# EAGLE design lm3410-sepic-flashlight-driver-17mm-mk-1.1.0 (EAGLE 9.2.0)
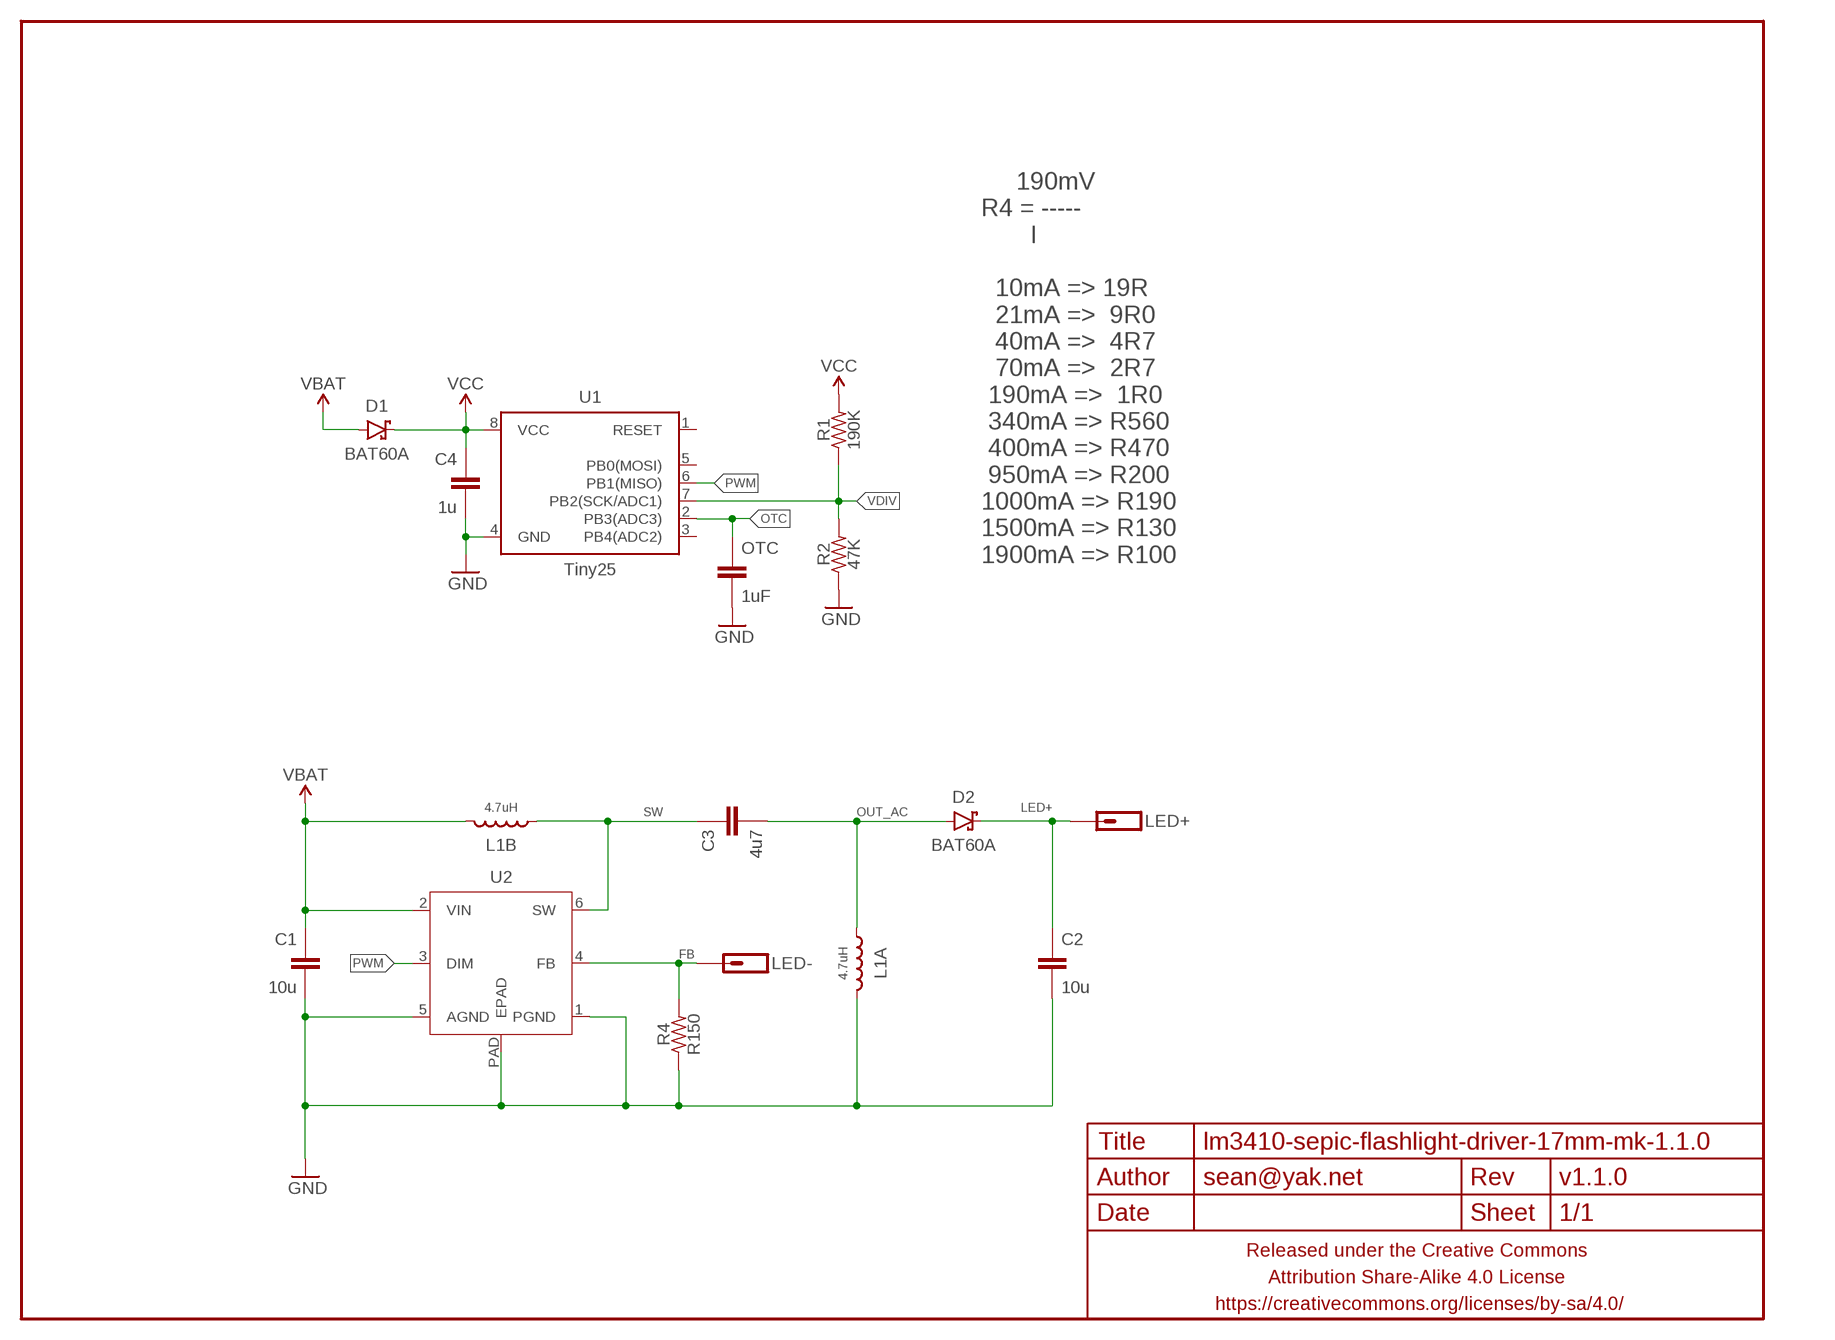
[diagram p0: schematic, sheet 1]

## Parts
C1  10u  CAPACITOR-CERAMICC0805-TIGHTER  [C0805-TIGHTER]
C2  10u  CAPACITOR-CERAMICC0805-TIGHTER  [C0805-TIGHTER]
C3  4u7  CAPACITOR-CERAMICC0805-TIGHTER  [C0805-TIGHTER]
C4  1u  CAPACITOR-CERAMICC0402  [C0402]
D1  BAT60A  DIODE-SCHOTTKYSOD323  [SOD323-SCHOTTKY]
D2  BAT60A  DIODE-SCHOTTKYSOD323  [SOD323-SCHOTTKY]
FRAME1  FRAME-LETTERNO_PACKAGE  [DUMMY]
L1  4.7uH  INDUCTOR-DUALCOILCRAFT-LPD5030-SMALLER  [LPD5030-SMALLER-PADS]
LED+  M01PTH-1MM-CIR-NS  [1X01-1MM-CIR-NS]
LED-  M01PTH-1MM-CIR-NS  [1X01-1MM-CIR-NS]
OTC  1uF  CAPACITOR-CERAMICC0402  [C0402]
R1  190K  RESISTORR0402  [R0402]
R2  47K  RESISTORR0402  [R0402]
R4  R150  RESISTORR0805-TIGHTER  [R0805-TIGHTER]
U1  Tiny25  ATTINY45TINY25-SOICN-NARROWER  [SO08-SKINNYPADS]
U2  LM3410XSDNGG  [DFN300X300X80-7N]

## Nets
FB: LED-.1 R4.2 U2.4(FB)
GND: C1.2 C2.2 C4.2 L1.2 OTC.2 R2.1 R4.1 U1.4(GND) U2.1(PGND) U2.5(AGND) U2.PAD(EPAD)
LED+: C2.1 D2.C LED+.1
OTC: OTC.1 U1.2(PB3(ADC3))
OUT_AC: C3.2 D2.A L1.1
PWM: U1.6(PB1(MISO)) U2.3(DIM)
SW: C3.1 L1.4 U2.6(SW)
VBAT: C1.1 D1.A L1.3 U2.2(VIN)
VCC: C4.1 D1.C R1.2 U1.8(VCC)
VDIV: R1.1 R2.2 U1.7(PB2(SCK/ADC1))
Unconnected: U1.1(RESET) U1.3(PB4(ADC2)) U1.5(PB0(MOSI))

## Notes on the sheet
- 190mV
  R4 = -----
         I
  
    10mA => 19R
    21mA =>  9R0
    40mA =>  4R7
    70mA =>  2R7
   190mA =>  1R0
   340mA => R560
   400mA => R470
   950mA => R200
  1000mA => R190
  1500mA => R130
  1900mA => R100

## Library data of the parts
C1-C4 OTC = a_parts:CAPACITOR-CERAMIC: CAPACITOR, European symbol
D1 D2 = a_parts:DIODE-SCHOTTKY: Schottky diodes in SFE's production catalog BAT20J 1A 23V 0.62Vf RB751 120mA 40V 0.37Vf PMEG4005EJ 0.5A 40V 0.42Vf MBRA140 1A 40V 0.5Vf B340A 3A 40V SMA
FRAME1 = a_parts:FRAME-LETTER: Schematic Frame Standard 8.5x11 US Letter frame; DESIGNER: sean@yak.net; VERSION: v1.1.0
L1 = a_parts:INDUCTOR-DUAL
LED+ LED- = a_parts:M01: Header 1 Standard 1-pin 0.1" header. Use with straight break away headers (SKU : PRT-00116), right angle break away headers (PRT-00553), swiss pins (PRT-00743), machine pins (PRT-00117), and female headers (PRT-00115).
R1 R2 R4 = a_parts:RESISTOR: RESISTOR, American symbol
U1 = a_parts:ATTINY45: Atmel 8-pin 2/4/8kB flash uC
U2 = a_parts:LM3410XSD: Constant Current Boost and SEPIC LED Driver; MPN: LM3410XSD; OC_FARNELL: -; OC_NEWARK: 11N9218; PACKAGE: DFN-6; SUPPLIER: National Semiconductor

## Board
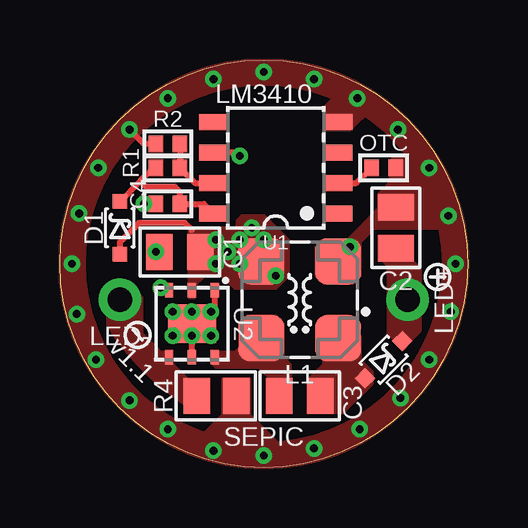
[diagram p1: board, top side]
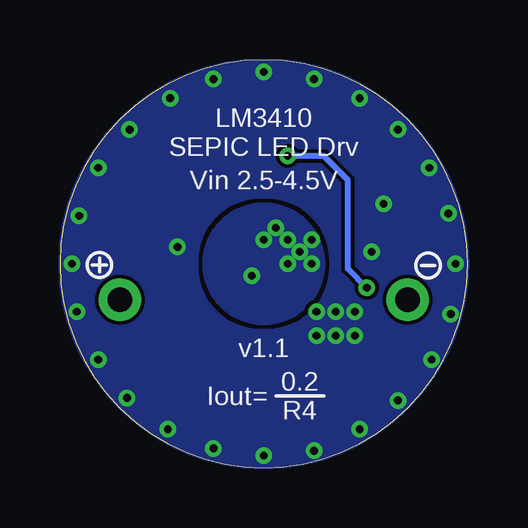
[diagram p2: board, bottom side, seen from below]

Size 17 x 17 mm. Coordinates in mm from the lower left corner, seen from the top.
Outline: 0,8.5 arc-180 17,8.5 arc-180 0,8.5
Copper layers (1*16): Top 0.0356mm / dielectric 1.5011mm / Bottom 0.0356mm
Design rules "LaenPCBOrder2 *": minimum track width 6mil, minimum drill 13mil, track to track 6mil, track to pad 6mil, pad to pad 6mil, via to via 6mil, smd to smd 6mil, copper to edge 0mil, drill to drill 6mil, minimum pad ring 7mil, minimum via ring 7mil, stop-mask expansion 3mil, vias tented up to drill 20mil, thermal gap 10mil

### Footprints (pad centres in the part's own frame; a part is rotated, then mirrored left to right if it is on the bottom)
C0805-TIGHTER = smd 1.1 x 1.5: 1 -0.85,0; 2 0.85,0
C0402 = smd 0.6 x 0.7: 1 -0.5,0; 2 0.5,0
SOD323-SCHOTTKY = smd 0.6 x 0.6: A -1.1,0; C 1.1,0
LPD5030-SMALLER-PADS = smd 1.9 x 1.9: 1 -1.6,1.6; 2 -1.6,-1.6; 3 1.6,-1.6; 4 1.6,1.6
1X01-1MM-CIR-NS = drill 1.016 pad 1.778: 1 0,0
R0402 = smd 0.6 x 0.7: 1 -0.5,0; 2 0.5,0
R0805-TIGHTER = smd 1.1 x 1.5: 1 -0.85,0; 2 0.8,0
SO08-SKINNYPADS = smd 0.65 x 1.2: 1 -1.905,-2.6; 2 -0.635,-2.6; 3 0.635,-2.6; 4 1.905,-2.6; 5 1.905,2.6; 6 0.635,2.6; 7 -0.635,2.6; 8 -1.905,2.6
DFN300X300X80-7N = smd 0.6 x 0.35: 1 -1.4,0.95; 2 -1.4,0; 3 -1.4,-0.95; 4 1.4,-0.95; 5 1.4,0; 6 1.4,0.95 | smd 1.6 x 2: PAD 0,0

### Placement (x,y rotation side)
C1  5,9 180 top
C2  14,10 90 top
C3  10,3 0 top
C4  4.5,11 180 top
D1  2.5,10 90 top
D2  13.5,4.5 45 top
FRAME1  0,0 0 top
L1  10,7 180 top
LED+  14.5,7 270 top
LED-  2.5,7 180 top
OTC  13.5,12.5 0 top
R1  4.5,12.5 180 top
R2  4.5,13.5 0 top
R4  6.5,3 180 top
U1  9,12.5 90 top
U2  5.5,6 270 top

### Tracks (layer width: path | path; a pad name or v marks a point on that pad's centre or on a via)
FB
  pour Top (no thermals): 2.5,7.5 3,7.5 3.4,7.1 3.4,5.6 4.2,4.8 4.6,4.8 4.6,4.4 6,3 6,2.5 5.5,2.5 arc-30 2,6 2,7
GND  (via drill 0.33)
  Top 0.152: U2.PAD v5.5,5.5 | C1.2 v4,9
  Top 0.25: C4.2 v3.5,11 | R2.1 3.5,13.5 v2.9,14.1 | U2.1 6.45,6.65 v6.3,6.5 | U2.5 v5.5,5.5
  other vias: 0.5,8.5 8.5,16.5 8.5,0.5 14.2,2.9 16.5,8.5 14.1,14.1 2.9,2.8 1.5,4.5 4.5,1.6 12.5,1.6 0.7,6.4 6.4,16.2 4.5,15.4 12.4,15.4 15.4,12.5 16.2,10.5 10.6,0.8 15.4,4.5 1.6,12.5 0.8,10.6 10.6,16.2 16.3,6.5 6.4,0.7 5.5,6.5 6.3,5.5 4.7,6.5 4.7,5.5 12.1,9.2
  pour Top (isolate 0.152, rank 6, no thermals): 0,8.5 arc90 8.5,0 arc90 17,8.5 16,8.5 arc-90 8.5,1 arc-90 1,8.5
  pour Bottom (isolate 0.152, rank 6, no thermals): 8.5,0 arc-90 0,8.5 arc-90 8.5,17 arc-90 17,8.5 arc-90
  pour Top (isolate 0.152, rank 6, no thermals): 17,8.5 arc90 8.5,17 arc90 0,8.5 1,8.5 arc-90 8.5,16 arc-90 16,8.5
  pour Top (no thermals): 11.5,15.5 11,15 11,14.1 12.1,14.1 13,15 12.5,15.5
  pour Top (no thermals): 15.5,13 14,13 13.8,12.8 13.8,11.9 13.3,11.4 13.3,10.8 12,9.5 11,9.5 10.7,9.2 10.7,8 11,7.7 12.2,7.7 12.5,8 12.5,9.4 13.1,10 16.5,10 16.5,11 15.5,12
  pour Top (no thermals): 6.8,3.7 7.9,3.7 7.9,2.2 9,1.1 9,0.5 6.5,0.5 6,1 5.6,1 6.8,2.2
LED+
  pour Top (no thermals): 13.7,5.6 14.3,5 15,5.7 15,8.3 14.7,8.6 14.7,8.9 14.4,9.2 13.7,9.2 13.4,8.9 13.4,8.7 13.7,8.4
OTC
  Top 0.25: U1.2 12.37,11.87 OTC.1
OUT_AC
  pour Top (no thermals): 11,6 12,6 12.5,5.5 12.5,4.5 13,4 13,3.5 11.8,2.3 10.4,2.3 10.4,3.7 11,4.3
PWM  (via drill 0.33)
  Top 0.25: U2.3 4.45,7.5 v4.2,7.5 | v7.5,13 7.37,13.13 U1.6
  Bottom 0.25: v4.2,7.5 5,8.3 5,12 6,13 v7.5,13
SW
  pour Top (no thermals): 6.4,4.8 7.3,4.8 7.5,5 7.5,6 7.8,6.3 9,6.3 9.3,6 9.3,4.6 9.6,4.3 9.6,2.6 9.5,2.5 8.8,2.5 8.7,2.6 8.7,3.8 8.3,4.2 6.5,4.2 6.4,4.3
VBAT  (via drill 0.33)
  Top 0.25: D1.A 2.5,9.4 3.3,10.2 5.2,10.2 5.5,9.9
  Bottom 0.4: 8.6,9.6 v8.5,9.5
  other vias: 7.5,9.5 8,10 7.5,8.5 7,9 6.5,8.5 6.5,9.5 9,8
  pour Bottom (isolate 0.152, no thermals): 6,8.5 arc-180 11,8.5 arc-180
  pour Top (no thermals): 5.4,7.1 5.6,7.1 5.6,7.6 6,8 6.8,8 7.3,7.5 9,7.5 9.5,8 9.5,9.5 8.5,10.5 7.6,10.5 7.4,10.3 7.4,10.1 7.3,10 5.4,10
VCC
  Top 0.25: D1.C 3.35,11.95 | 3.35,11.95 3.9,12.5 R1.2 | U1.8 6,11 C4.1 5,11.5 4.8,11.7 3.6,11.7 3.35,11.95
VDIV
  Top 0.25: R2.2 R1.1 5.63,11.87 U1.7

### Text on the board
tPlace: LM3410 | SEPIC
bPlace: LM3410 / SEPIC LED Drv | Vin 2.5-4.5V | 0.2 | Iout= | R4